# EAGLE schematic ArduinoBoard (EAGLE 9.3.1)

## Sheet 1 of 2: ARDUINO
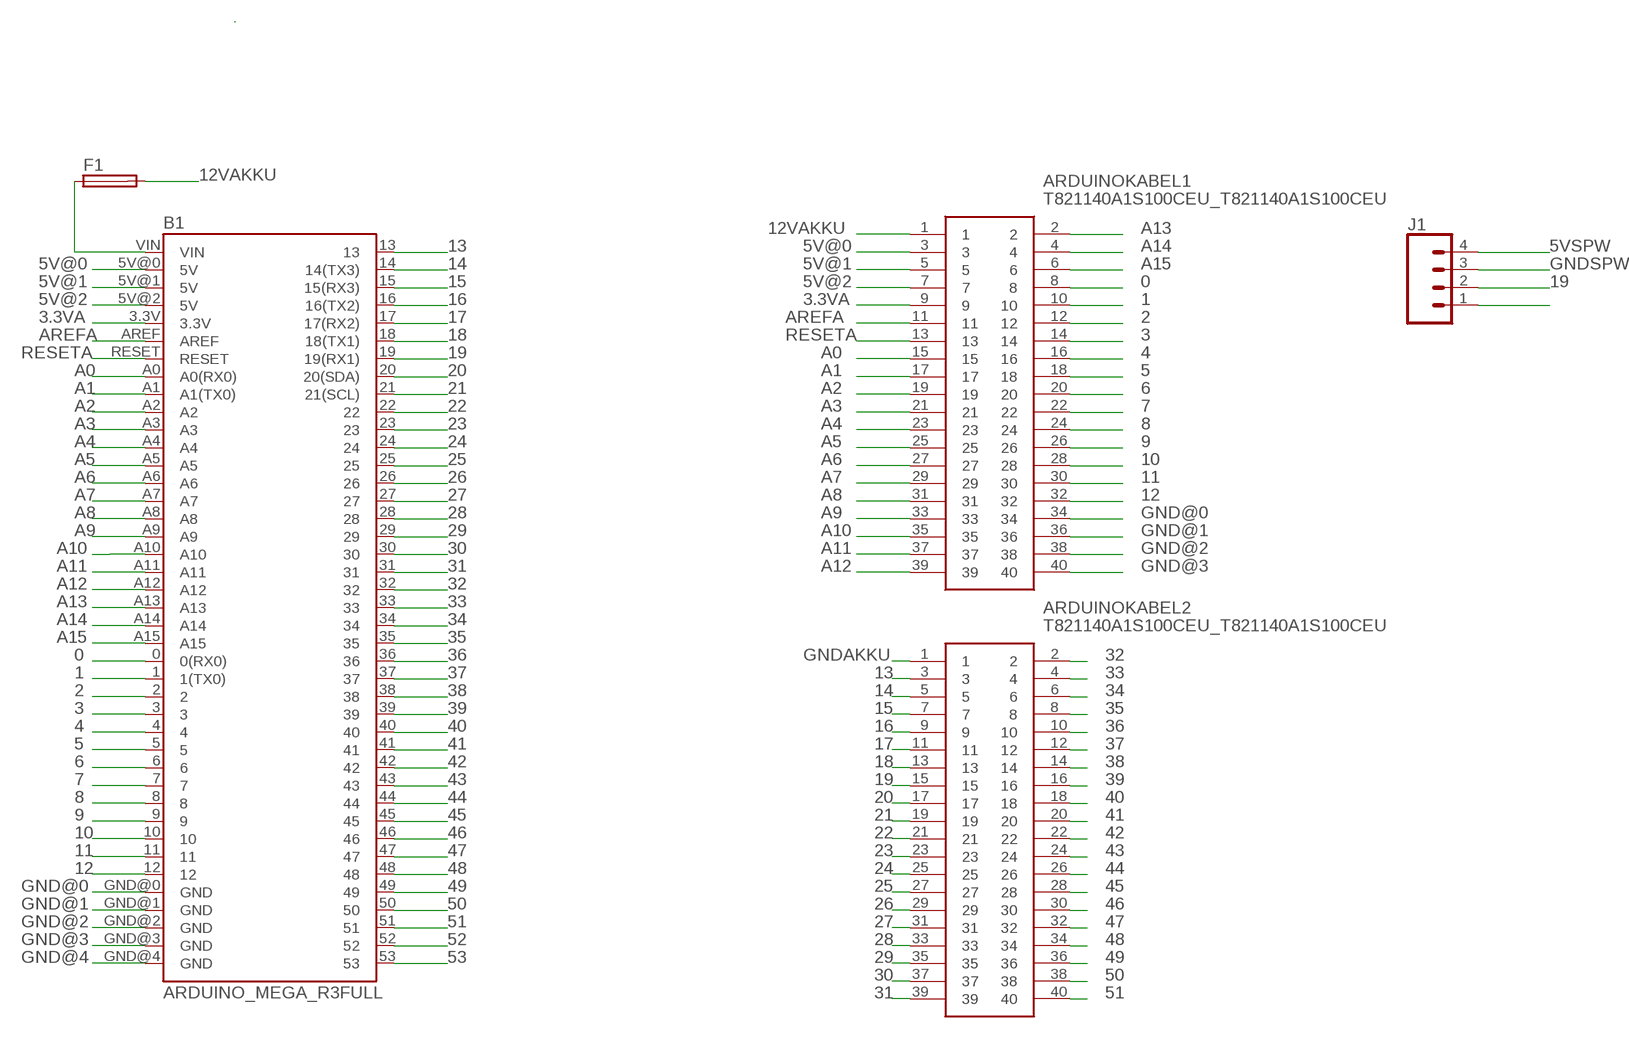
[diagram p0: schematic, sheet 1]

### Parts
ARDUINOKABEL1  T821140A1S100CEU_T821140A1S100CEU  [T821140A1S100CEU_SHDR40W64P254X254_2X20_5842X89]
ARDUINOKABEL2  T821140A1S100CEU_T821140A1S100CEU  [T821140A1S100CEU_SHDR40W64P254X254_2X20_5842X89]
B1  ARDUINO_MEGA_R3FULL  [ARDUINO_MEGA]
F1  SH25  [SH25]
J1  CONN_04  [1X04]

### Nets
0 [0.4A (low-power)]: ARDUINOKABEL1.8 B1.0(0(RX0))
1 [0.4A (low-power)]: ARDUINOKABEL1.10 B1.1(1(TX0))
2 [0.4A (low-power)]: ARDUINOKABEL1.12 B1.2 ; also sheet 2
3 [0.4A (low-power)]: ARDUINOKABEL1.14 B1.3 ; also sheet 2
3.3VA [0.4A (low-power)]: ARDUINOKABEL1.9 B1.3.3V
4 [0.4A (low-power)]: ARDUINOKABEL1.16 B1.4 ; also sheet 2
5 [0.4A (low-power)]: ARDUINOKABEL1.18 B1.5 ; also sheet 2
5V@0 [1A]: ARDUINOKABEL1.3 B1.5V@0(5V) ; also sheet 2
5V@1 [1A]: ARDUINOKABEL1.5 B1.5V@1(5V)
5V@2 [1A]: ARDUINOKABEL1.7 B1.5V@2(5V)
5VSPW: J1.4
6: ARDUINOKABEL1.20 B1.6 ; also sheet 2
7 [0.4A (low-power)]: ARDUINOKABEL1.22 B1.7
8 [0.4A (low-power)]: ARDUINOKABEL1.24 B1.8 ; also sheet 2
9 [0.4A (low-power)]: ARDUINOKABEL1.26 B1.9
10 [0.4A (low-power)]: ARDUINOKABEL1.28 B1.10
11 [0.4A (low-power)]: ARDUINOKABEL1.30 B1.11
12 [0.4A (low-power)]: ARDUINOKABEL1.32 B1.12
12VAKKU [2A]: ARDUINOKABEL1.1 F1.2
13 [0.4A (low-power)]: ARDUINOKABEL2.3 B1.13
14 [0.4A (low-power)]: ARDUINOKABEL2.5 B1.14(14(TX3))
15 [0.4A (low-power)]: ARDUINOKABEL2.7 B1.15(15(RX3))
16 [0.4A (low-power)]: ARDUINOKABEL2.9 B1.16(16(TX2))
17 [0.4A (low-power)]: ARDUINOKABEL2.11 B1.17(17(RX2))
18 [0.4A (low-power)]: ARDUINOKABEL2.13 B1.18(18(TX1)) ; also sheet 2
19 [0.4A (low-power)]: ARDUINOKABEL2.15 B1.19(19(RX1)) J1.2 ; also sheet 2
20 [0.4A (low-power)]: ARDUINOKABEL2.17 B1.20(20(SDA))
21 [0.4A (low-power)]: ARDUINOKABEL2.19 B1.21(21(SCL))
22 [0.4A (low-power)]: ARDUINOKABEL2.21 B1.22
23 [0.4A (low-power)]: ARDUINOKABEL2.23 B1.23
24 [0.4A (low-power)]: ARDUINOKABEL2.25 B1.24
25 [0.4A (low-power)]: ARDUINOKABEL2.27 B1.25
26 [0.4A (low-power)]: ARDUINOKABEL2.29 B1.26
27 [0.4A (low-power)]: ARDUINOKABEL2.31 B1.27
28 [0.4A (low-power)]: ARDUINOKABEL2.33 B1.28
29 [0.4A (low-power)]: ARDUINOKABEL2.35 B1.29
30 [0.4A (low-power)]: ARDUINOKABEL2.37 B1.30
31: ARDUINOKABEL2.39 B1.31
32 [0.4A (low-power)]: ARDUINOKABEL2.2 B1.32
33 [0.4A (low-power)]: ARDUINOKABEL2.4 B1.33
34 [0.4A (low-power)]: ARDUINOKABEL2.6 B1.34
35 [0.4A (low-power)]: ARDUINOKABEL2.8 B1.35
36 [0.4A (low-power)]: ARDUINOKABEL2.10 B1.36
37 [0.4A (low-power)]: ARDUINOKABEL2.12 B1.37
38 [0.4A (low-power)]: ARDUINOKABEL2.14 B1.38
39 [7A]: ARDUINOKABEL2.16 B1.39
40 [0.4A (low-power)]: ARDUINOKABEL2.18 B1.40
41: ARDUINOKABEL2.20 B1.41
42 [0.4A (low-power)]: ARDUINOKABEL2.22 B1.42
43 [0.4A (low-power)]: ARDUINOKABEL2.24 B1.43
44: ARDUINOKABEL2.26 B1.44
45: ARDUINOKABEL2.28 B1.45
46 [0.4A (low-power)]: ARDUINOKABEL2.30 B1.46
47 [0.4A (low-power)]: ARDUINOKABEL2.32 B1.47
48 [0.4A (low-power)]: ARDUINOKABEL2.34 B1.48
49 [0.4A (low-power)]: ARDUINOKABEL2.36 B1.49
50 [0.4A (low-power)]: ARDUINOKABEL2.38 B1.50
51 [0.4A (low-power)]: ARDUINOKABEL2.40 B1.51
52: B1.52
53: B1.53
A0 [0.4A (low-power)]: ARDUINOKABEL1.15 B1.A0(A0(RX0))
A1 [0.4A (low-power)]: ARDUINOKABEL1.17 B1.A1(A1(TX0))
A2 [0.4A (low-power)]: ARDUINOKABEL1.19 B1.A2
A3 [0.4A (low-power)]: ARDUINOKABEL1.21 B1.A3
A4: ARDUINOKABEL1.23 B1.A4
A5 [0.4A (low-power)]: ARDUINOKABEL1.25 B1.A5
A6 [0.4A (low-power)]: ARDUINOKABEL1.27 B1.A6
A7 [0.4A (low-power)]: ARDUINOKABEL1.29 B1.A7
A8 [0.4A (low-power)]: ARDUINOKABEL1.31 B1.A8
A9 [0.4A (low-power)]: ARDUINOKABEL1.33 B1.A9
A10 [0.4A (low-power)]: ARDUINOKABEL1.35 B1.A10
A11 [0.4A (low-power)]: ARDUINOKABEL1.37 B1.A11
A12 [0.4A (low-power)]: ARDUINOKABEL1.39 B1.A12
A13: ARDUINOKABEL1.2 B1.A13
A14 [0.4A (low-power)]: ARDUINOKABEL1.4 B1.A14
A15 [0.4A (low-power)]: ARDUINOKABEL1.6 B1.A15
AREFA [0.4A (low-power)]: ARDUINOKABEL1.11 B1.AREF
GND@0 [1A]: ARDUINOKABEL1.34 B1.GND@0(GND) ; also sheet 2
GND@1 [1A]: ARDUINOKABEL1.36 B1.GND@1(GND)
GND@2 [1A]: ARDUINOKABEL1.38 B1.GND@2(GND)
GND@3 [1A]: ARDUINOKABEL1.40 B1.GND@3(GND)
GND@4: B1.GND@4(GND)
GNDAKKU [2A]: ARDUINOKABEL2.1
GNDSPW: J1.3
N$4: J1.1
RESETA [0.4A (low-power)]: ARDUINOKABEL1.13 B1.RESET
VIN: B1.VIN F1.1

## Sheet 2 of 2: ULTRAS
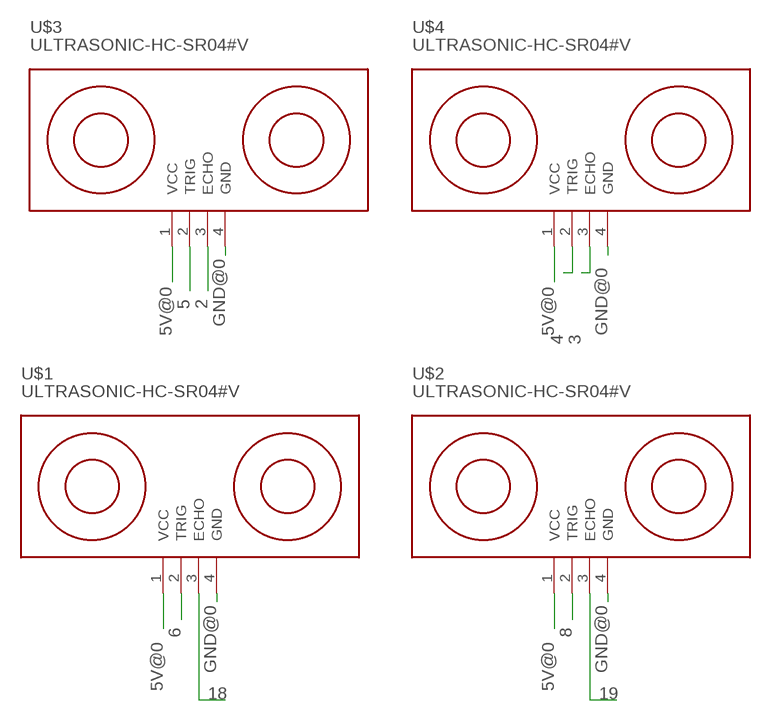
[diagram p1: schematic, sheet 2]

### Parts
U$1  ULTRASONIC-HC-SR04#V  [ULTRASONIC-HC-SR04#V]
U$2  ULTRASONIC-HC-SR04#V  [ULTRASONIC-HC-SR04#V]
U$3  ULTRASONIC-HC-SR04#V  [ULTRASONIC-HC-SR04#V]
U$4  ULTRASONIC-HC-SR04#V  [ULTRASONIC-HC-SR04#V]

### Nets
2 [0.4A (low-power)]: U$3.3(ECHO) ; also sheet 1
3 [0.4A (low-power)]: U$4.3(ECHO) ; also sheet 1
4 [0.4A (low-power)]: U$4.2(TRIG) ; also sheet 1
5 [0.4A (low-power)]: U$3.2(TRIG) ; also sheet 1
5V@0 [1A]: U$1.1(VCC) U$2.1(VCC) U$3.1(VCC) U$4.1(VCC) ; also sheet 1
6: U$1.2(TRIG) ; also sheet 1
8 [0.4A (low-power)]: U$2.2(TRIG) ; also sheet 1
18 [0.4A (low-power)]: U$1.3(ECHO) ; also sheet 1
19 [0.4A (low-power)]: U$2.3(ECHO) ; also sheet 1
GND@0 [1A]: U$1.4(GND) U$2.4(GND) U$3.4(GND) U$4.4(GND) ; also sheet 1

## Library data of the parts
ARDUINOKABEL1 ARDUINOKABEL2 = BörningComponents:T821140A1S100CEU_T821140A1S100CEU: AMPHENOL - T821140A1S100CEU - HEADER, VERTICAL, 2.54MM, 40WAY Source: Datasheet <http://www.farnell.com/datasheets/1648843.pdf>; ARROW_PART_NUMBER: T821140A1S100CEU; DESCRIPTION: AMPHENOL - T821140A1S100CEU - HEADER, VERTICAL, 2.54MM, 40WAY; HEIGHT: 9.15mm; MANUFACTURER_NAME: Amphenol; MANUFACTURER_PART_NUMBER: T821140A1S100CEU
B1 = SparkFun-Boards:ARDUINO_MEGA_R3: Arduino Mega R3 ATmega2560 R3 compatible footprint. SparkFun Products: Arduino Mega 2560 R3 <https://www.sparkfun.com/products/11061>
F1 = fuse:SH25: FUSE HOLDER grid 25 mm, OGN0031 8211, Schurter (Buerklin); MF: SCHURTER; MPN: 0031.8211; OC_FARNELL: 1162741; OC_NEWARK: 96B9380
J1 = SparkFun-Connectors:CONN_04: Multi connection point. Often used as Generic Header-pin footprint for 0.1 inch spaced/style header connections On any of the 0.1 inch spaced packages, you can populate with these: Break Away Headers - Straight <https://www.sparkfun.com/products/116> (PRT-00116) Break Away Male Headers - Right Angle <https://www.sparkfun.com/products/553> (PRT-00553) Female Headers <https://www.sparkfun.com/products/115> (PRT-00115) Break Away Headers - Machine Pin <https://www.sparkfun.com/products/117> (PRT-00117) Break Away Female Headers - Swiss Machine Pin <https://www.sparkfun.com/products/743> (PRT-00743) For SCREWTERMINALS and SPRING TERMINALS visit here: Screw Terimnals on SparkFun.com <https://www.sparkfun.com/search/results?term=Screw+Terminals> (5mm/3.5mm/2.54mm spacing) This device is also useful as a general connection point to wire up your design to another part of your project. Our various solder wires solder well into these plated through hole pads. Hook-Up Wire - Assortment (Stranded, 22 AWG) <https://www.sparkfun.com/products/11375> (PRT-11375) Hook-Up Wire - Assortment (Solid Core, 22 AWG) <https://www.sparkfun.com/products/11367> (PRT-11367) View the entire wire category on our website here <https://www.sparkfun.com/categories/141> Special notes: Molex polarized connector foot print use with SKU : PRT-08231 with associated crimp pins and housings. 1MM SMD Version SKU: PRT-10208; PROD_ID: CONN-09696
U$1-U$4 = diy-modules:ULTRASONIC-HC-SR04: Ultrasonic Ranging Module HC-SR04 More details available here: http://randomnerdtutorials.com/complete-guide-for-ultrasonic-sensor-hc-sr04/ Click here to find device on ebay.com <http://www.ebay.com/sch/hc+sr04+ultrasonic>

## Net classes
0 default: clearance 0.1 mm
1 0.7A: width 0.2 mm, clearance 0.1 mm
2 1A: width 0.3 mm, clearance 0.1 mm
3 2A: width 0.8 mm, clearance 0.15 mm
4 3A: width 1.4 mm, clearance 0.15 mm
5 7A: width 5 mm, clearance 0.2 mm
6 0.4A (low-power): width 0.1 mm, clearance 0.05 mm
7 10A: width 6.5 mm, clearance 0.3 mm